# EAGLE schematic template (EAGLE 7.7.0)
DRAWING_NUMBER: V001; DRAWN: Mario Blunk / Blunk electronic; PROJECT: agile HW demo; STATUS: development

## Sheet 1 of 3
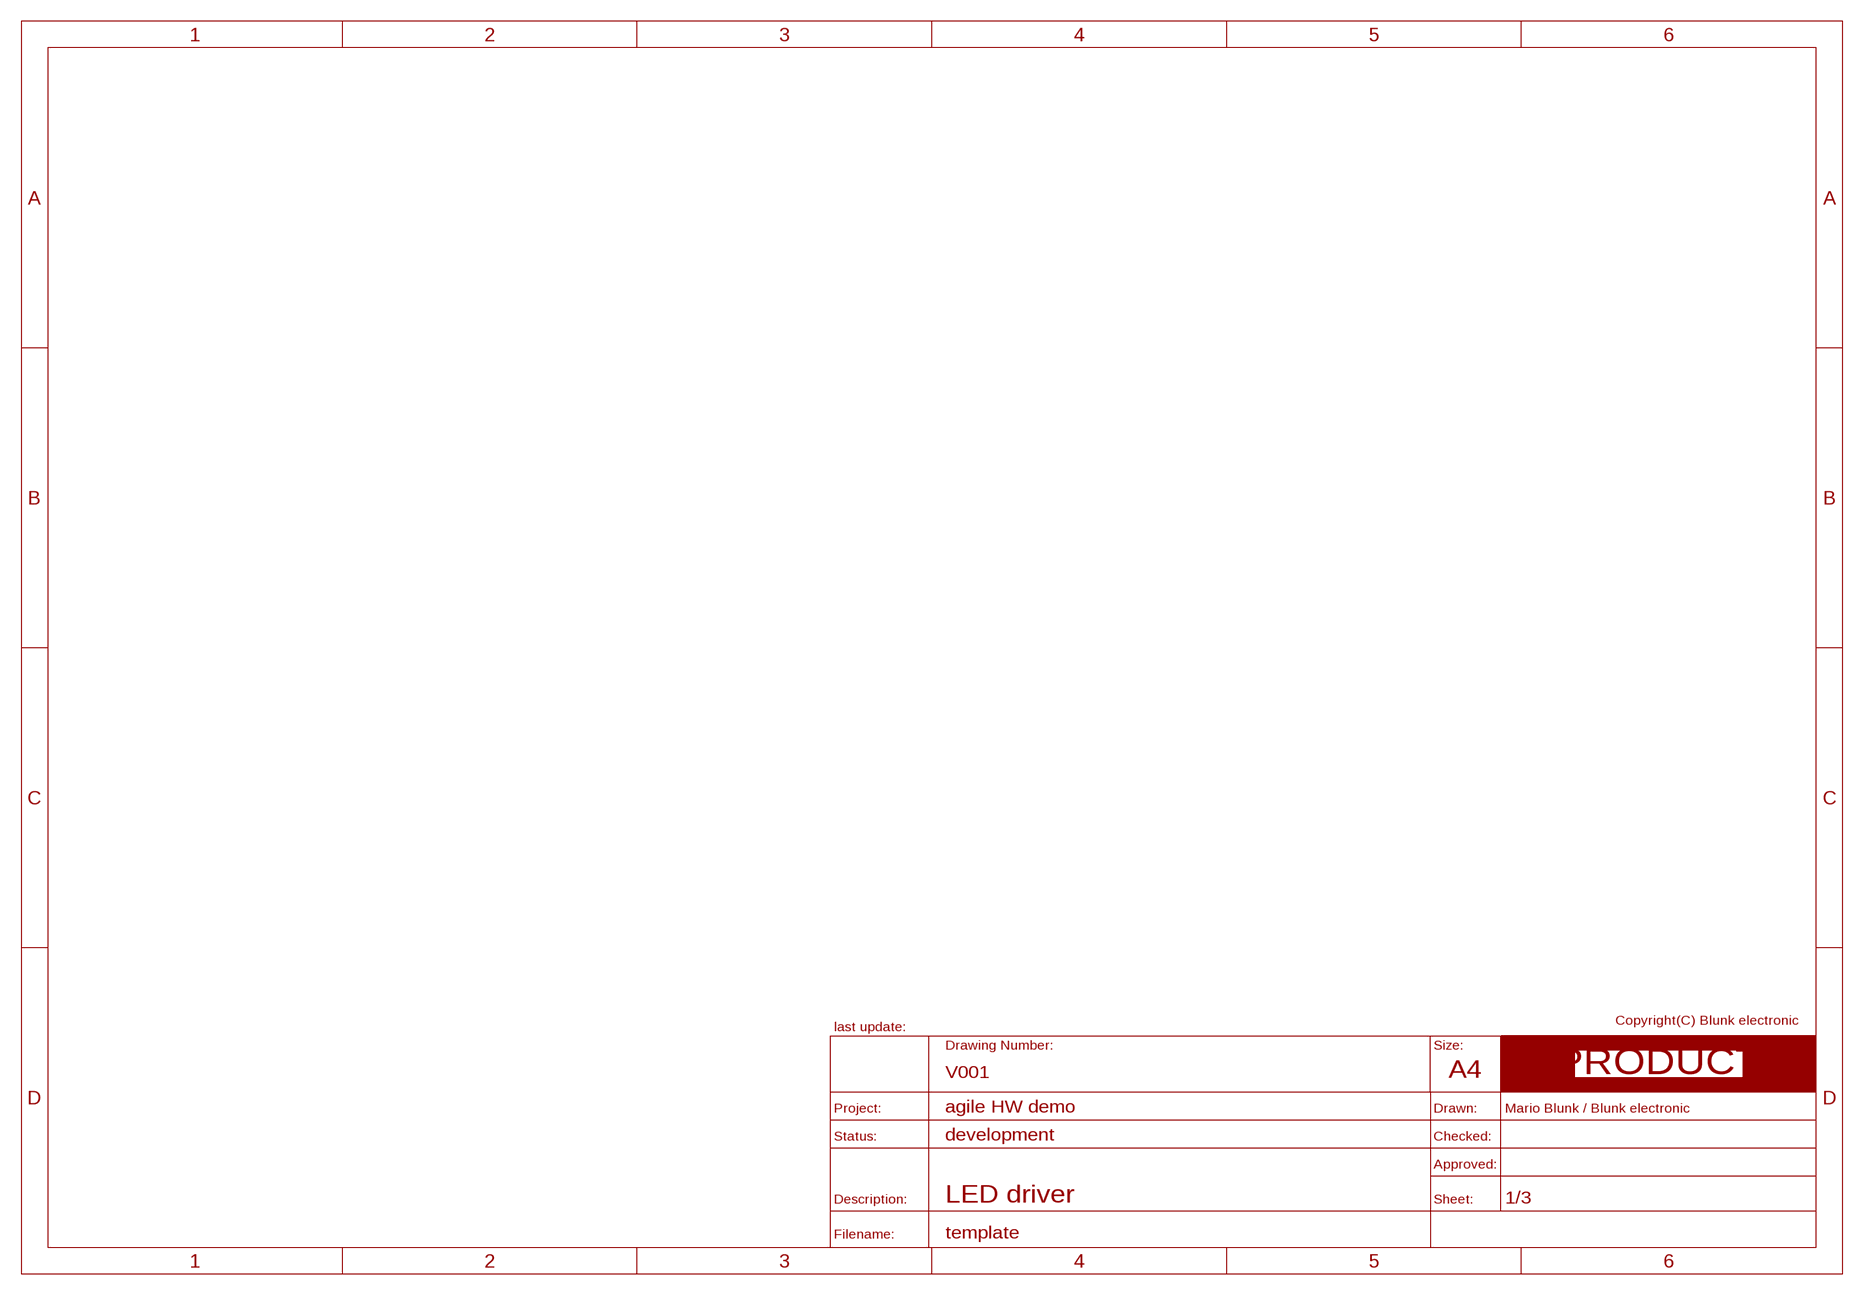
[diagram p0: schematic, sheet 1]
FRAME_PRODUCT1 (A4_LANDSCAPE_PRODUCT): BOM: NO; COMMISSIONED: 2013-08-30; DESCRIPTION: LED driver

## Sheet 2 of 3
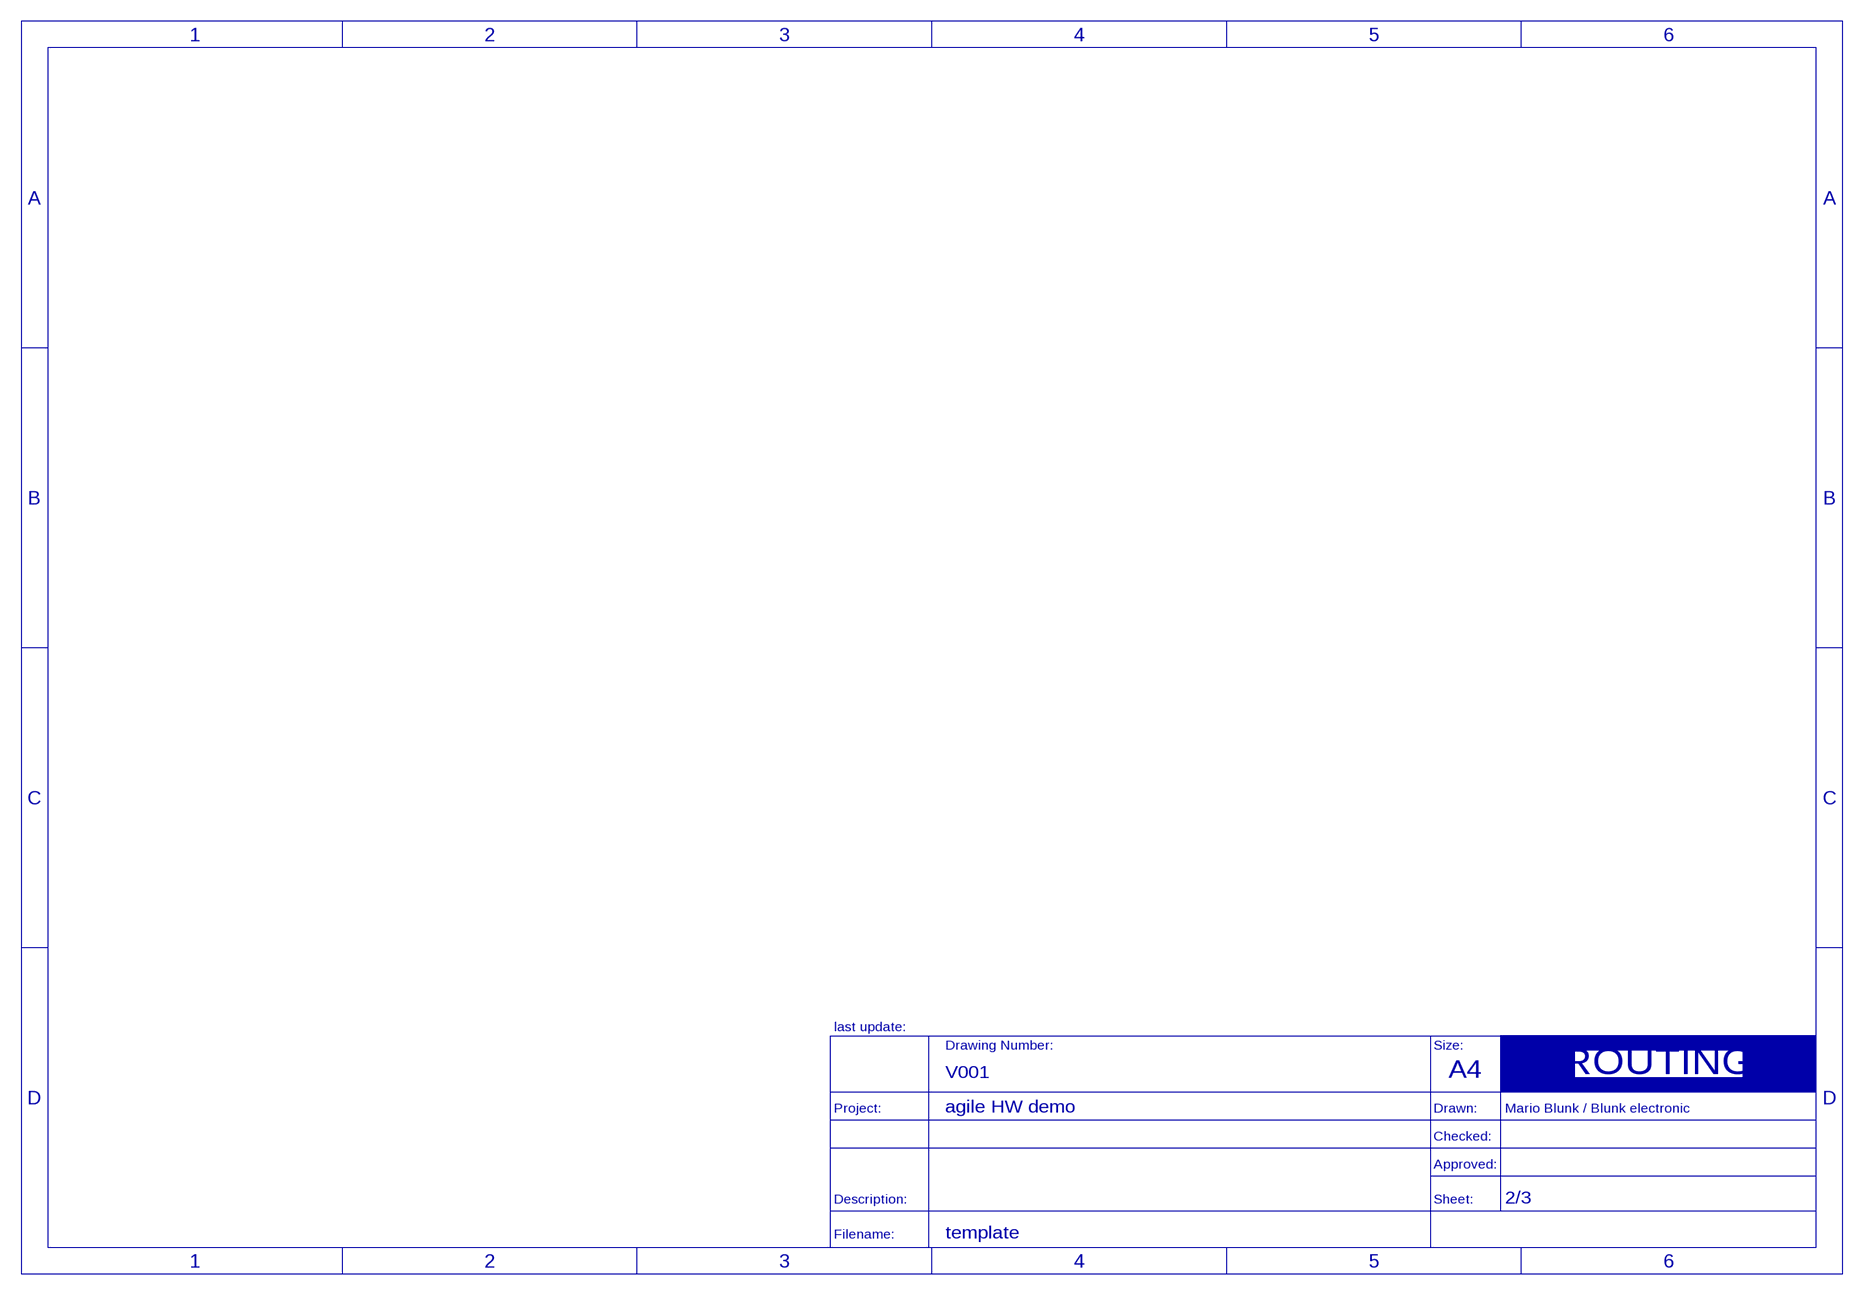
[diagram p1: schematic, sheet 2]
FRAME_NET_CHANGERS1 (A4_LANDSCAPE_NET_CHANGERS): BOM: NO; COMMISSIONED: 2013-08-30

## Sheet 3 of 3
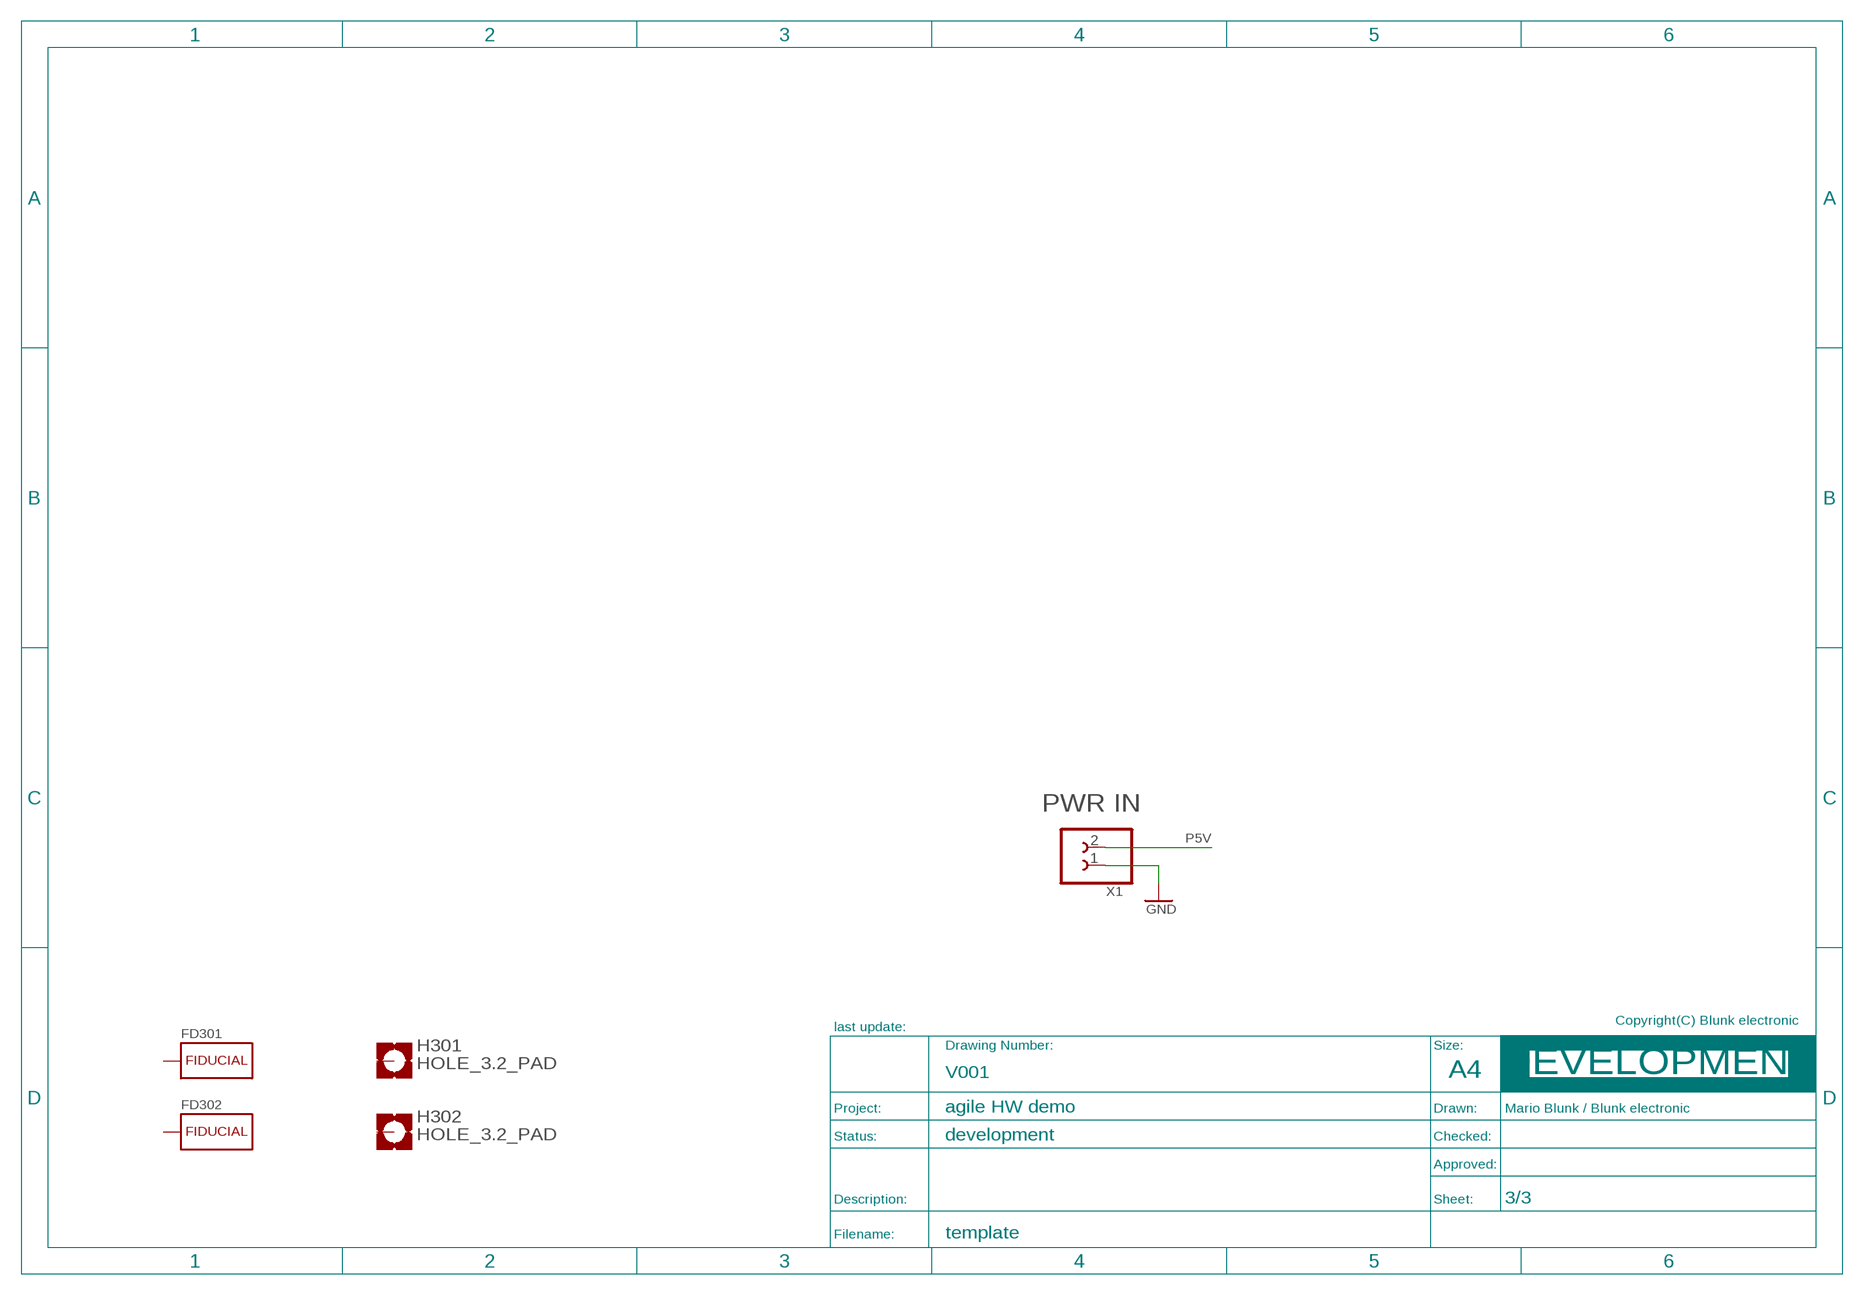
[diagram p2: schematic, sheet 3]
FRAME_DEVELOPMENT1 (A4_LANDSCAPE_DEVELOPMENT): BOM: NO; COMMISSIONED: 2013-08-30

### Parts
FD301  FIDUCIAL_CROSSHAIR  [CROSSHAIR]
FD302  FIDUCIAL_CROSSHAIR  [CROSSHAIR]
H301  HOLE_3.2_PAD  [3.2_PAD]
H302  HOLE_3.2_PAD  [3.2_PAD]
X1  CLAMP_1X2-T-2.5MM  [T_WIRE_CLAMP_1X2_PITCH_2MM5]

### Nets
GND: X1.1
P5V: X1.2
Unconnected: FD301.1(NC) FD302.1(NC) H301.H1(MOUNT) H302.H1(MOUNT)

## Library data of the parts
FD301 FD302 = be_marks:FIDUCIAL: drawn: Mario Blunk / Blunk electronic; BOM: NO; COMMISSIONED: 2013-12-03
H301 H302 = be_holes:HOLE: edited: Mario Blunk; BOM: NO; COMMISSIONED: 2015-01-15
X1 = be_con_jump:CLAMP_1X2: drawn: Mario Blunk / Blunk electronic; BOM: YES; COMMISSIONED: 2014-04-14; FUNCTION: PWR IN; PART_CODE_BEL: X_PAC_T_CLAMP_1X2_PITCH_2mm5